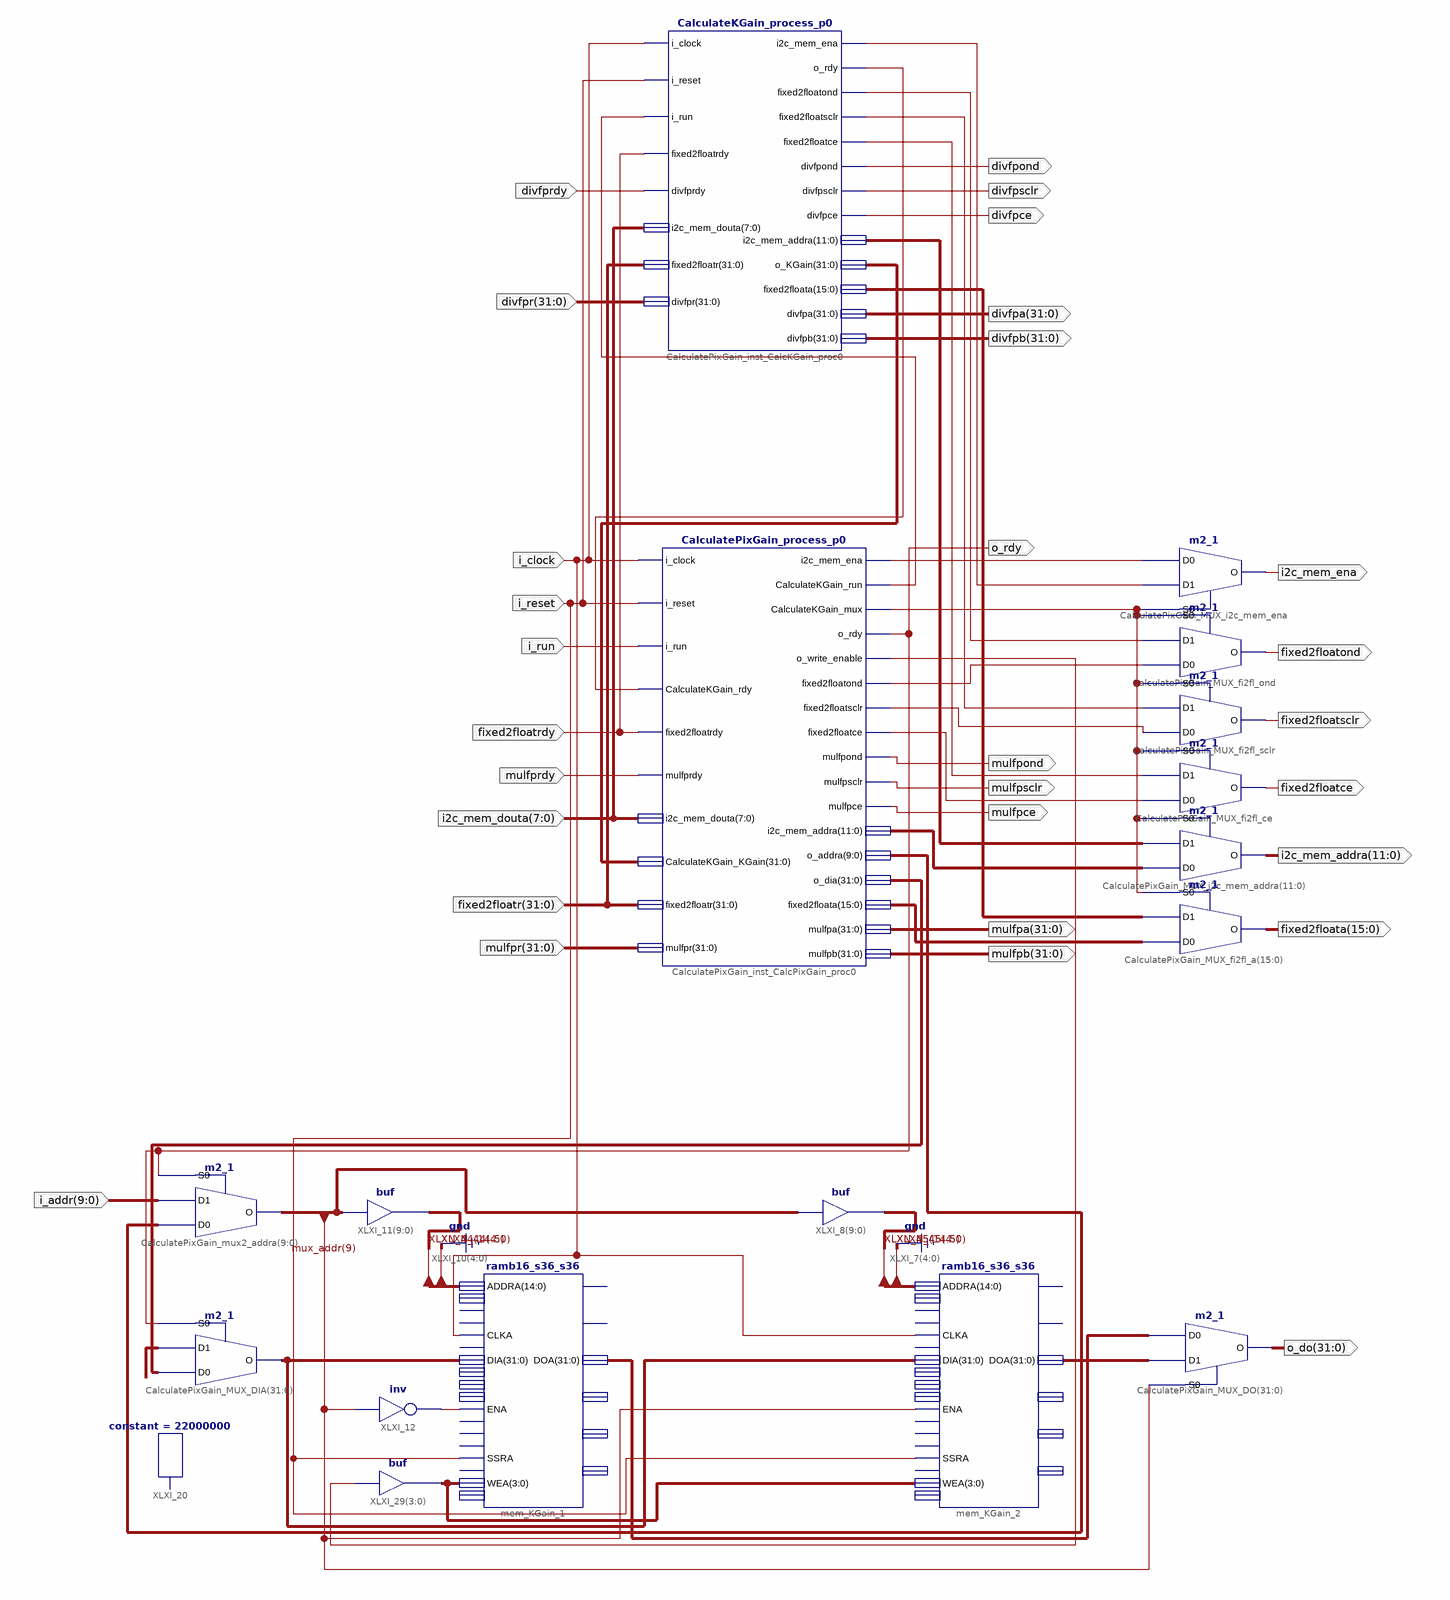
[diagram p0: schematic sheet 1]
// Xilinx ISE schematic CalculatePixGain.sch (virtex4) as structural Verilog: 18 symbols, 29 ports
module CalculatePixGain (
  input  [7:0] i2c_mem_douta,
  input  [9:0] i_addr,
  input  [31:0] fixed2floatr,
  input  fixed2floatrdy,
  input  i_clock,
  input  i_reset,
  input  i_run,
  input  mulfprdy,
  input  [31:0] mulfpr,
  input  divfprdy,
  input  [31:0] divfpr,
  output i2c_mem_ena,
  output [11:0] i2c_mem_addra,
  output [15:0] fixed2floata,
  output fixed2floatond,
  output fixed2floatsclr,
  output fixed2floatce,
  output [31:0] mulfpb,
  output [31:0] mulfpa,
  output mulfpond,
  output mulfpsclr,
  output mulfpce,
  output [31:0] divfpb,
  output [31:0] divfpa,
  output divfpce,
  output divfpsclr,
  output divfpond,
  output o_rdy,
  output [31:0] o_do
);

  wire XLXN_59, XLXN_109, XLXN_112, XLXN_113, XLXN_117, XLXN_132, XLXN_133, XLXN_134, XLXN_135, XLXN_136,
       XLXN_137, XLXN_140, XLXN_155;
  wire [3:0] XLXN_139;
  wire [9:0] mux_addr, XLXN_86;
  wire [11:0] XLXN_114, XLXN_115;
  wire [14:5] XLXN_44, XLXN_45;
  wire [15:0] XLXN_118, XLXN_119;
  wire [31:0] XLXN_78, XLXN_79, XLXN_88, XLXN_141, XLXN_157, XLXN_158;

  CalculateKGain_process_p0 CalculatePixGain_inst_CalcKGain_proc0 (
    .i_clock(i_clock), .i_reset(i_reset), .i_run(XLXN_117), .fixed2floatrdy(fixed2floatrdy),
    .divfprdy(divfprdy), .i2c_mem_douta(i2c_mem_douta), .fixed2floatr(fixed2floatr), .divfpr(divfpr),
    .i2c_mem_ena(XLXN_112), .o_rdy(XLXN_155), .fixed2floatond(XLXN_135), .fixed2floatsclr(XLXN_136),
    .fixed2floatce(XLXN_137), .divfpond(divfpond), .divfpsclr(divfpsclr), .divfpce(divfpce),
    .i2c_mem_addra(XLXN_115), .o_KGain(XLXN_141), .fixed2floata(XLXN_119), .divfpa(divfpa), .divfpb(divfpb));
  CalculatePixGain_process_p0 CalculatePixGain_inst_CalcPixGain_proc0 (
    .i_clock(i_clock), .i_reset(i_reset), .i_run(i_run), .CalculateKGain_rdy(XLXN_155),
    .fixed2floatrdy(fixed2floatrdy), .mulfprdy(mulfprdy), .i2c_mem_douta(i2c_mem_douta),
    .CalculateKGain_KGain(XLXN_141), .fixed2floatr(fixed2floatr), .mulfpr(mulfpr), .i2c_mem_ena(XLXN_109),
    .CalculateKGain_run(XLXN_117), .CalculateKGain_mux(XLXN_113), .o_rdy(o_rdy), .o_write_enable(XLXN_140),
    .fixed2floatond(XLXN_132), .fixed2floatsclr(XLXN_134), .fixed2floatce(XLXN_133), .mulfpond(mulfpond),
    .mulfpsclr(mulfpsclr), .mulfpce(mulfpce), .i2c_mem_addra(XLXN_114), .o_addra(XLXN_86), .o_dia(XLXN_157),
    .fixed2floata(XLXN_118), .mulfpa(mulfpa), .mulfpb(mulfpb));
  ramb16_s36_s36 #(.WRITE_WIDTH_B(36), .WRITE_WIDTH_A(36), .WRITE_MODE_B("READ_FIRST"), .WRITE_MODE_A("READ_FIRST"), .READ_WIDTH_B(36), .READ_WIDTH_A(36)) mem_KGain_1 (
    .ADDRA({XLXN_44, {5{1'b0}}}), .CLKA(i_clock), .DIA(XLXN_88), .ENA(XLXN_59), .SSRA(i_reset),
    .WEA(XLXN_139), .DOA(XLXN_79));  // open: ADDRB, CASCADEINA, CASCADEINB, CLKB, DIB, DIPA, DIPB, REGCEA, REGCEB, ENB, SSRB, WEB, CASCADEOUTA, CASCADEOUTB, DOB, DOPA, DOPB
  ramb16_s36_s36 #(.WRITE_WIDTH_B(36), .WRITE_WIDTH_A(36), .WRITE_MODE_B("READ_FIRST"), .WRITE_MODE_A("READ_FIRST"), .READ_WIDTH_B(36), .READ_WIDTH_A(36)) mem_KGain_2 (
    .ADDRA({XLXN_45, {5{1'b0}}}), .CLKA(i_clock), .DIA(XLXN_88), .ENA(mux_addr[9]), .SSRA(i_reset),
    .WEA(XLXN_139), .DOA(XLXN_78));  // open: ADDRB, CASCADEINA, CASCADEINB, CLKB, DIB, DIPA, DIPB, REGCEA, REGCEB, ENB, SSRB, WEB, CASCADEOUTA, CASCADEOUTB, DOB, DOPA, DOPB
  assign XLXN_45 = mux_addr;  // buf XLXI_8[9..0], 10 bits wide
  assign XLXN_44 = mux_addr;  // buf XLXI_11[9..0], 10 bits wide
  not XLXI_12 (XLXN_59, mux_addr[9]);
  m2_1 CalculatePixGain_MUX_DO[31:0] (.D0(XLXN_79), .D1(XLXN_78), .S0(mux_addr[9]), .O(o_do));
  m2_1 CalculatePixGain_mux2_addra[9:0] (.D0(XLXN_86), .D1(i_addr), .S0(o_rdy), .O(mux_addr));
  m2_1 CalculatePixGain_MUX_DIA[31:0] (.D0(XLXN_157), .D1(XLXN_158), .S0(o_rdy), .O(XLXN_88));
  constant #(.CValue("22000000")) XLXI_20 (.O(XLXN_158));
  m2_1 CalculatePixGain_MUX_i2c_mem_ena (.D0(XLXN_109), .D1(XLXN_112), .S0(XLXN_113), .O(i2c_mem_ena));
  m2_1 CalculatePixGain_MUX_i2c_mem_addra[11:0] (.D0(XLXN_114), .D1(XLXN_115), .S0(XLXN_113), .O(i2c_mem_addra));
  m2_1 CalculatePixGain_MUX_fi2fl_a[15:0] (.D0(XLXN_118), .D1(XLXN_119), .S0(XLXN_113), .O(fixed2floata));
  m2_1 CalculatePixGain_MUX_fi2fl_ond (.D0(XLXN_132), .D1(XLXN_135), .S0(XLXN_113), .O(fixed2floatond));
  m2_1 CalculatePixGain_MUX_fi2fl_sclr (.D0(XLXN_134), .D1(XLXN_136), .S0(XLXN_113), .O(fixed2floatsclr));
  m2_1 CalculatePixGain_MUX_fi2fl_ce (.D0(XLXN_133), .D1(XLXN_137), .S0(XLXN_113), .O(fixed2floatce));
  assign XLXN_139 = {4{XLXN_140}};  // buf XLXI_29[3..0], 4 bits wide
endmodule
